# Altium schematic sheet TH8_EEM_connector.SchDoc: Stabilizer
size 420 x 297 mm; Author: G.Kasprowicz; CompanyName: WUT ISE; DrawnBy: G.Kasprowicz; Organization: WUT ISE; Address1: PW ISE; Address2: Nowowiejska 15/19 00-665 Warsaw; Address3: gkasprow@gmail.com; DocumentNumber: 7; Revision: 1.0; SheetNumber: 7; SheetTotal: 9; ModifiedBy: -; CheckedDate: -; Title2: EEM connector & drivers; DivGrp: WUT ISE; Designer: G.Kasprowicz; ModifiedDate: -; ProjectName: Sensor Box
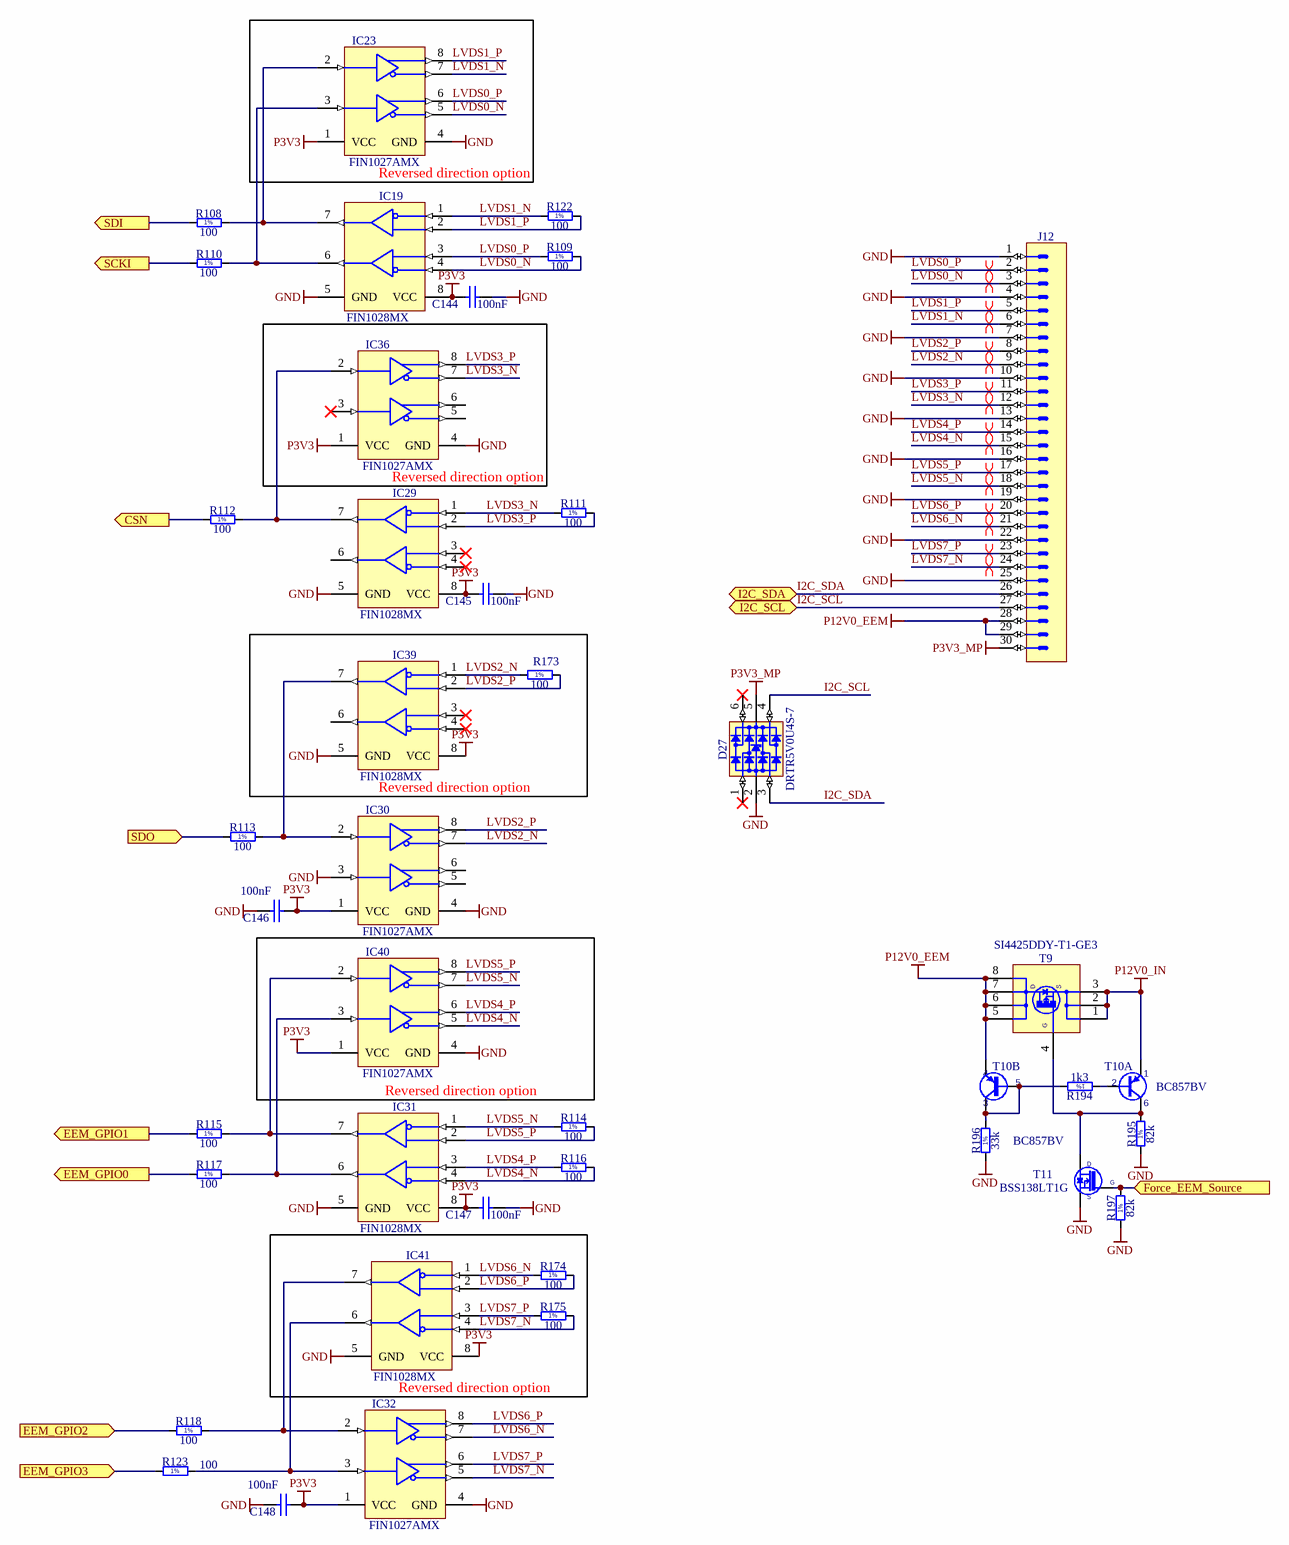
[diagram p0: TH8_EEM_connector.SchDoc]

## Parts
C144  100nF  [CAPC1005X55N]
C145  100nF  [CAPC1005X55N]
C146  100nF  [CAPC1005X55N]
C147  100nF  [CAPC1005X55N]
C148  100nF  [CAPC1005X55N]
D27  DRTR5V0U4S-7  [SOT65P210X110-6N]
IC19  FIN1028MX  [SOIC127P600X175-8N]
IC23  FIN1027AMX  [SOIC127P600X175-8N]
IC29  FIN1028MX  [SOIC127P600X175-8N]
IC30  FIN1027AMX  [SOIC127P600X175-8N]
IC31  FIN1028MX  [SOIC127P600X175-8N]
IC32  FIN1027AMX  [SOIC127P600X175-8N]
IC36  FIN1027AMX  [SOIC127P600X175-8N]
IC39  FIN1028MX  [SOIC127P600X175-8N]
IC40  FIN1027AMX  [SOIC127P600X175-8N]
IC41  FIN1028MX  [SOIC127P600X175-8N]
J12  (no value)  [3M_N2530-6002RB]
R108  100  [RESC1005X40N]
R109  100  [RESC1005X40N]
R110  100  [RESC1005X40N]
R111  100  [RESC1005X40N]
R112  100  [RESC1005X40N]
R113  100  [RESC1005X40N]
R114  100  [RESC1005X40N]
R115  100  [RESC1005X40N]
R116  100  [RESC1005X40N]
R117  100  [RESC1005X40N]
R118  100  [RESC1005X40N]
R122  100  [RESC1005X40N]
R123  100  [RESC1005X40N]
R173  100  [RESC1005X40N]
R174  100  [RESC1005X40N]
R175  100  [RESC1005X40N]
R194  1k3  [RESC1608X55N]
R195  82k  [RESC1608X55N]
R196  33k  [RESC1005X40N]
R197  82k  [RESC1608X55N]
T9  SI4425DDY-T1-GE3  [SOIC127P600X175-8N]
T10  BC857BV  [SOTFL50P160X60-6N]  (parts A,B of 2)
T11  BSS138LT1G  [SOT95P240X110-3N]

## Blocks framed on the sheet
Reversed direction option: IC23
Reversed direction option: IC36
Reversed direction option: IC39 R173
Reversed direction option: IC40
Reversed direction option: IC41 R174 R175

## Ports
CSN (out), EEM_GPIO0 (out), EEM_GPIO1 (out), EEM_GPIO2 (in), EEM_GPIO3 (in), Force_EEM_Source (in), I2C_SCL (bidir), I2C_SDA (bidir), SCKI (out), SDI (out), SDO (in)

## Nets
GND: C144.1 C145.1 C146.1 C147.1 C148.1 D27.2(GND) IC19.5(GND) IC23.4(GND) IC29.5(GND) IC30.3(DIN2RIN-) IC30.4(GND) IC31.5(GND) IC32.4(GND) IC36.4(GND) IC39.5(GND) IC40.4(GND) IC41.5(GND) J12.1 J12.4 J12.7 J12.10 J12.13 J12.16 J12.19 J12.22 J12.25 R195.1 R196.1 R197.1 T11.2(S)
P3V3: C144.2 C145.2 C146.2 C147.2 C148.2 IC19.8(VCC) IC23.1(VCC) IC29.8(VCC) IC30.1(VCC) IC31.8(VCC) IC32.1(VCC) IC36.1(VCC) IC39.8(VCC) IC40.1(VCC) IC41.8(VCC)
P3V3_MP: D27.5(VBUS) J12.30
P12V0_EEM: J12.28 J12.29 T9.5(D) T9.6(D) T9.7(D) T9.8(D) T10.4(E)
P12V0_IN: T9.1(S) T9.2(S) T9.3(S) T10.1(E)
CSN: R112.1 ; port CSN
EEM_GPIO0: R117.1 ; port EEM_GPIO0
EEM_GPIO1: R115.1 ; port EEM_GPIO1
EEM_GPIO2: R118.1 ; port EEM_GPIO2
EEM_GPIO3: R123.1 ; port EEM_GPIO3
Force_EEM_Source: R197.2 T11.1(G) ; port Force_EEM_Source
I2C_SCL: D27.4(I/O3) J12.27 ; port I2C_SCL
I2C_SDA: D27.3(I/O2) J12.26 ; port I2C_SDA
LVDS0_N: IC19.4(RIN2-) IC23.5(DOUT-) J12.3 R109.2
LVDS0_P: IC19.3(RIN2+) IC23.6(DOUT+) J12.2 R109.1
LVDS1_N: IC19.1(RIN1-) IC23.7(DOUT-) J12.6 R122.1
LVDS1_P: IC19.2(RIN1+) IC23.8(DOUT+) J12.5 R122.2
LVDS2_N: IC30.7(DOUT-) IC39.1(RIN1-) J12.9 R173.1
LVDS2_P: IC30.8(DOUT+) IC39.2(RIN1+) J12.8 R173.2
LVDS3_N: IC29.1(RIN1-) IC36.7(DOUT-) J12.12 R111.1
LVDS3_P: IC29.2(RIN1+) IC36.8(DOUT+) J12.11 R111.2
LVDS4_N: IC31.4(RIN2-) IC40.5(DOUT-) J12.15 R116.2
LVDS4_P: IC31.3(RIN2+) IC40.6(DOUT+) J12.14 R116.1
LVDS5_N: IC31.1(RIN1-) IC40.7(DOUT-) J12.18 R114.1
LVDS5_P: IC31.2(RIN1+) IC40.8(DOUT+) J12.17 R114.2
LVDS6_N: IC32.7(DOUT-) IC41.1(RIN1-) J12.21 R174.1
LVDS6_P: IC32.8(DOUT+) IC41.2(RIN1+) J12.20 R174.2
LVDS7_N: IC32.5(DOUT-) IC41.4(RIN2-) J12.24 R175.2
LVDS7_P: IC32.6(DOUT+) IC41.3(RIN2+) J12.23 R175.1
SCKI: R110.1 ; port SCKI
SDI: R108.1 ; port SDI
SDO: R113.1 ; port SDO
NetIC19_6: IC19.6(ROUT2) IC23.3(DIN2RIN-) R110.2
NetIC19_7: IC19.7(ROUT1) IC23.2(DIN1) R108.2
NetIC29_7: IC29.7(ROUT1) IC36.2(DIN1) R112.2
NetIC30_2: IC30.2(DIN1) IC39.7(ROUT1) R113.2
NetIC31_6: IC31.6(ROUT2) IC40.3(DIN2RIN-) R117.2
NetIC31_7: IC31.7(ROUT1) IC40.2(DIN1) R115.2
NetIC32_2: IC32.2(DIN1) IC41.7(ROUT1) R118.2
NetIC32_3: IC32.3(DIN2RIN-) IC41.6(ROUT2) R123.2
NetR194_1: R194.1 T10.2(B)
NetR194_2: R194.2 R196.2 T10.3(C) T10.5(B)
NetR195_2: R195.2 T9.4(S) T10.6(C) T11.3(D)

Not connected (* = marked no-connect by the designer): D27 1(I/O1)* 6(I/O4)*; IC29 3(RIN2+)* 4(RIN2-)* 6(ROUT2); IC30 5(DOUT-) 6(DOUT+); IC36 3(DIN2RIN-)* 5(DOUT-) 6(DOUT+); IC39 3(RIN2+)* 4(RIN2-)* 6(ROUT2)

## Layout directives
differential pair: LVDS0_N, LVDS0_P, LVDS1_N, LVDS1_P, LVDS2_N, LVDS2_P, LVDS3_N, LVDS3_P, LVDS4_N, LVDS4_P, LVDS5_N, LVDS5_P, LVDS6_N, LVDS6_P, LVDS7_N, LVDS7_P

## Notes on the sheet
- Project/Equipment
- Document
- Designer
- Drawn by
- Check.by
- Copyright WUT ISE 2020.
  This documentation describes Open Hardware and is licensed under the CERN OHL v.1.2. You may redistribute and modify this documentation under the terms of the CERN OHL v.1.2. (http://ohwr.org/CERNOHL). This documentation is distributed WITHOUT ANY EXPRESS OR IMPLIED WARRANTY, INCLUDING OF MERCHANTABILITY, SATISFACTORY QUALITY AND FITNESS FOR A PARTICULAR PURPOSE. Please see the CERN OHL v.1.2 for applicable conditions.
- Contact
- File
- Last Mod.
- Print Date
- Sheet
- Size
- A3
- of
- Rev
- (in symbol R0402_33K_1%_0.0625W_100PPM) 1%
- (in symbol R0402_100R_1%_0.0625W_100PPM) 1%
- (in symbol R0603_1K3_1%_0.1W_100PPM) 1%
- (in symbol R0603_82K_1%_0.1W_100PPM) 1%
- (in symbol SI4425DDY-T1-GE3) G

## Library data of the parts
C144-C148 = CC0402_100NF_16V_10%_X5R: Non-polarised capacitor; Part Description: SMD Multilayer Chip Ceramic Capacitor; Manufacturer: GENERIC; Manufacturer1 Part Number: GRM155R61C104KA88D; Voltage: 16V; TC: X5R; Tolerance: ±10%; Part Number: CC0402_100NF_16V_10%_X5R; Component Kind: Standard; Component Type: Standard; Pin Count: 2; Value: 100nF; Status: None; Manufacturer Part Number: CC0402_100NF_16V_10%_X5R; Case: 0402; Mounted: Yes; Socket: No; SMD: Yes; Sense: No; Manufacturer1 Example: MURATA; Manufacturer1 ComponentHeight: 0.55mm; HelpURL: \\cern.ch\dfs\Applications\Altium\Datasheets\CC0402_X5R_MURATA_GRM.pdf; Author: CERN DEM JLC; CreateDate: 10.12.2013; LatestRevisionDate: 10.12.2013
D27 = D_TVS_DRTR5V0U4S-7: Integrated Quad Ultra-Low Capacitance ESD Protection; Part Description: Integrated Quad Ultra-Low Capacitance ESD (±8kV) Protection; Manufacturer: DIODES; PressFit: No; Bonding: No; Status Comment: Active; Part Number: DRTR5V0U4S-7; Component Kind: Standard; Component Type: Standard; Device: DRTR5V0U4S-7; PackageDescription: SOT363, SC70-6, 0.65mm Pitch; 6 Pin, 1.25mm W X 2.00mm L X 1.10mm H body, IPC Medium Density; Status: Active; Manufacturer Part Number: DRTR5V0U4S-7; Pin Count: 6; Case: SOT363; Mounted: Yes; Socket: No; SMD: Yes; Sense: No; ComponentHeight: 1.1mm; HelpURL: \\cern.ch\dfs\Applications\Altium\Datasheets\PRTR5V0U4Y.pdf; Author: GK; CreateDate: 24.01.2017; LatestRevisionDate: 14.09.2020
IC19 IC29 IC31 IC39 IC41 = IFC_FIN1028: 3.3V LVDS 2-Bit High-Speed Differential Reciever; Manufacturer: ON Semiconductor; PressFit: No; Bonding: No; Part Number: FIN1028MX; Component Kind: Standard; Component Type: Standard; Device: FIN1028MX; PackageDescription: SOIC 8, Pitch 1.27mm - Body 4x5mm, IPC Medium Density; Part Description: 3.3V LVDS 2-Bit High-Speed Differential Reciever; Manufacturer Part Number: FIN1028MX; Pin Count: 8; Case: SOIC8; Mounted: Yes; Socket: No; SMD: Yes; Sense: No; ComponentHeight: 0.8mm; Author: GK; HelpURL: \\cern.ch\dfs\Applications\Altium\Datasheets\FIN1101K8X.pdf; CreateDate: 08/11/2016; LatestRevisionDate: 08/11/2016
IC23 IC30 IC32 IC36 IC40 = IFC_FIN1027A: 3.3V LVDS, 2-Bit, High-Speed, Differential Driver; Manufacturer: ON Semiconductor; PressFit: No; Bonding: No; Part Number: FIN1027AMX; Component Kind: Standard; Component Type: Standard; Device: FIN1027AMX; PackageDescription: SOIC 8, Pitch 1.27mm - Body 4x5mm, IPC Medium Density; Part Description: 3.3V LVDS, 2-Bit, High-Speed, Differential Driver; Manufacturer Part Number: FIN1027AMX; Pin Count: 8; Case: SOIC8; Mounted: Yes; Socket: No; SMD: Yes; Sense: No; ComponentHeight: 0.8mm; Author: GK; HelpURL: \\cern.ch\dfs\Applications\Altium\Datasheets\FIN1101K8X.pdf; CreateDate: 08/11/2016; LatestRevisionDate: 08/11/2016
J12 = 3M_N2530-6002RB: Connector 30 Male; Part Description: 30 Contacts - Straight .100'' x .100'' Low Profile Four-Wall Header, 2500 Series; Manufacturer: 3M; PressFit: No; Part Number: 3M_N2530-6002RB; Component Kind: Standard; Component Type: Standard; Pin Count: 30; Family: Header 30; Mounted: Yes; Socket: No; SMD: No; Sense: No; Status: None; Manufacturer Part Number: N2530-6002RB; ComponentHeight: 10.03mm; HelpURL: \\cern.ch\dfs\Applications\Altium\Datasheets\3M_N2530-6002RB.pdf; Author: CERN DEM JLC; CreateDate: 11.02.2009; LatestRevisionDate: 11.08.2009
R108-R118 R122 R123 R173-R175 = R0402_100R_1%_0.0625W_100PPM: Resistor - 1%; Part Description: General Purpose Thick Film Chip Resistor; Manufacturer: GENERIC; Manufacturer1 Part Number: 232270671001L; TC: ±100ppm/°C; PressFit: No; Part Number: R0402_100R_1%_0.0625W_100PPM; Component Kind: Standard; Component Type: Standard; Pin Count: 2; Value: 100; Status: Not Recommended; Power: 0.0625W; Tolerance: ±1%; Manufacturer Part Number: R0402_100R_1%_0.0625W_100PPM; Case: 0402; Mounted: Yes; Sense: No; Socket: No; SMD: Yes; Manufacturer1 Example: YAGEO PHYCOMP; Manufacturer1 ComponentHeight: 0.4mm; HelpURL: \\cern.ch\dfs\Applications\Altium\Datasheets\R0402_Phycomp_RC0402.pdf; Author: CERN DEM JLC; CreateDate: 03.12.2007; LatestRevisionDate: 17.10.2012
R194 = R0603_1K3_1%_0.1W_100PPM: Resistor - 1%; Part Description: General Purpose Thick Film Chip Resistor; Manufacturer: GENERIC; Manufacturer1 Part Number: NRC06F1301TRF; Power: 0.1W; TC: ±100ppm/°C; PressFit: No; Part Number: R0603_1K3_1%_0.1W_100PPM; Component Kind: Standard; Component Type: Standard; Pin Count: 2; Value: 1k3; Status: Preferred; Tolerance: ±1%; Manufacturer Part Number: R0603_1K3_1%_0.1W_100PPM; Case: 0603; Mounted: Yes; Sense: No; Socket: No; SMD: Yes; Manufacturer1 Example: NIC COMPONENT; Manufacturer1 ComponentHeight: 0.55mm; HelpURL: \\cern.ch\dfs\Applications\Altium\Datasheets\R0603_NIC_NRC.pdf; Author: CERN DEM JLC; CreateDate: 03.12.2007; LatestRevisionDate: 13.03.2008
R195 R197 = R0603_82K_1%_0.1W_100PPM: Resistor - 1%; Part Description: General Purpose Thick Film Chip Resistor; Manufacturer: GENERIC; Manufacturer1 Part Number: NRC06F8202TRF; Power: 0.1W; TC: ±100ppm/°C; Part Number: R0603_82K_1%_0.1W_100PPM; Component Kind: Standard; Component Type: Standard; Pin Count: 2; Value: 82k; Status: Preferred; Tolerance: ±1%; Manufacturer Part Number: R0603_82K_1%_0.1W_100PPM; Case: 0603; Mounted: Yes; Sense: No; Socket: No; SMD: Yes; Manufacturer1 Example: NIC COMPONENT; Manufacturer1 ComponentHeight: 0.55mm; HelpURL: \\cern.ch\dfs\Applications\Altium\Datasheets\R0603_NIC_NRC.pdf; Author: CERN DEM JLC; CreateDate: 03.12.2007; LatestRevisionDate: 13.03.2008
R196 = R0402_33K_1%_0.0625W_100PPM: Resistor - 1%; Part Description: General Purpose Thick Film Chip Resistor; Manufacturer: GENERIC; Manufacturer1 Part Number: 232270673303L; TC: ±100ppm/°C; PressFit: No; Part Number: R0402_33K_1%_0.0625W_100PPM; Component Kind: Standard; Component Type: Standard; Pin Count: 2; Value: 33k; Status: Not Recommended; Power: 0.0625W; Tolerance: ±1%; Manufacturer Part Number: R0402_33K_1%_0.0625W_100PPM; Case: 0402; Mounted: Yes; Sense: No; Socket: No; SMD: Yes; Manufacturer1 Example: YAGEO PHYCOMP; Manufacturer1 ComponentHeight: 0.4mm; HelpURL: \\cern.ch\dfs\Applications\Altium\Datasheets\R0402_Phycomp_RC0402.pdf; Author: CERN DEM JLC; CreateDate: 03.12.2007; LatestRevisionDate: 17.10.2012
T9 = SI4425DDY-T1-GE3: -30V -19.7A P-Channel MOSFET; Manufacturer: VISHAY SILICONIX; PressFit: No; Bonding: No; Part Number: SI4425DDY-T1-GE3; Component Kind: Standard; Component Type: Standard; Device: SI4425DDY-T1-GE3; PackageDescription: SOIC 8, Pitch 1.27mm - Body 4x5mm, IPC Medium Density; Part Description: -30V -19.7A P-Channel MOSFET; Manufacturer Part Number: SI4425DDY-T1-GE3; Pin Count: 8; Case: SOIC8; Mounted: Yes; Socket: No; SMD: Yes; Sense: No; ComponentHeight: 1.75mm; HelpURL: \\cern.ch\dfs\Applications\Altium\Datasheets\SI4425DDY-T1-GE3.pdf; Author: CERN DEM MR; CreateDate: 05/10/2016; LatestRevisionDate: 05/10/2016
T10 = BC857BV: 45V, 100mA PNP General Purpose Double Transistor; Part Description: -45V -100mA PNP General Purpose Double Transistor; Manufacturer: NXP SEMICONDUCTORS; PressFit: No; Bonding: No; Part Number: BC857BV; Component Kind: Standard; Component Type: Standard; Device: BC857BV; PackageDescription: SOTFL (SOT666), 0.50mm, Pitch; 6 Pin, 1.20mm W X 1.60mm L X 0.60mm H Body, IPC Medium Density; Manufacturer Part Number: BC857BV; Pin Count: 6; Case: SOT666; Mounted: Yes; Socket: No; SMD: Yes; Sense: No; ComponentHeight: 0.6mm; HelpURL: \\cern.ch\dfs\Applications\Altium\Datasheets\BC857BV.pdf; Author: CERN DEM JLC; CreateDate: 01/12/2011; LatestRevisionDate: 01/12/2011
T11 = BSS138LT1G: N-CHANNEL MOSFET WITH DIODE; Part Description: 50V 200mA N-Channel Enhancement Mode Field-Effect Transistor; Manufacturer: ON SEMICONDUCTOR; PressFit: No; Bonding: No; Part Number: BSS138LT1G; Component Kind: Standard; Component Type: Standard; Device: BSS138LT1G; PackageDescription: SOT23 3-Leads, Pitch 0.95mm - Body 1.4x3mm, IPC Medium Density; Manufacturer Part Number: BSS138LT1G; Pin Count: 3; Case: SOT23-3; Mounted: Yes; Socket: No; SMD: Yes; Sense: No; ComponentHeight: 1.11mm; HelpURL: \\cern.ch\dfs\Applications\Altium\Datasheets\BSS138LT1G.pdf; Author: CERN DEM JLC; CreateDate: 23.03.2009; LatestRevisionDate: 23.03.2009